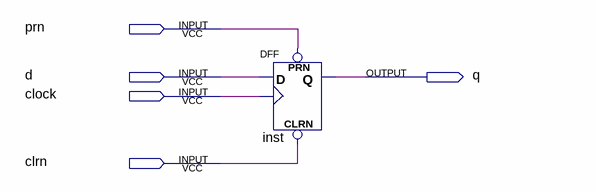
[diagram p0: schematic sheet]
// Quartus schematic mytest1.bdf as structural Verilog: 1 symbols, 5 pins
module mytest1 (
  input  prn,
  input  d,
  input  clock,
  input  clrn,
  output q
);

  DFF inst (.CLRN(clrn), .CLK(clock), .D(d), .PRN(prn), .Q(q));
endmodule
